# Altium project RX_test_01.PrjPcb (part 2 of 5)

## Sheet IF 1.SchDoc
size A3; SheetNumber: 4; SheetTotal: 13
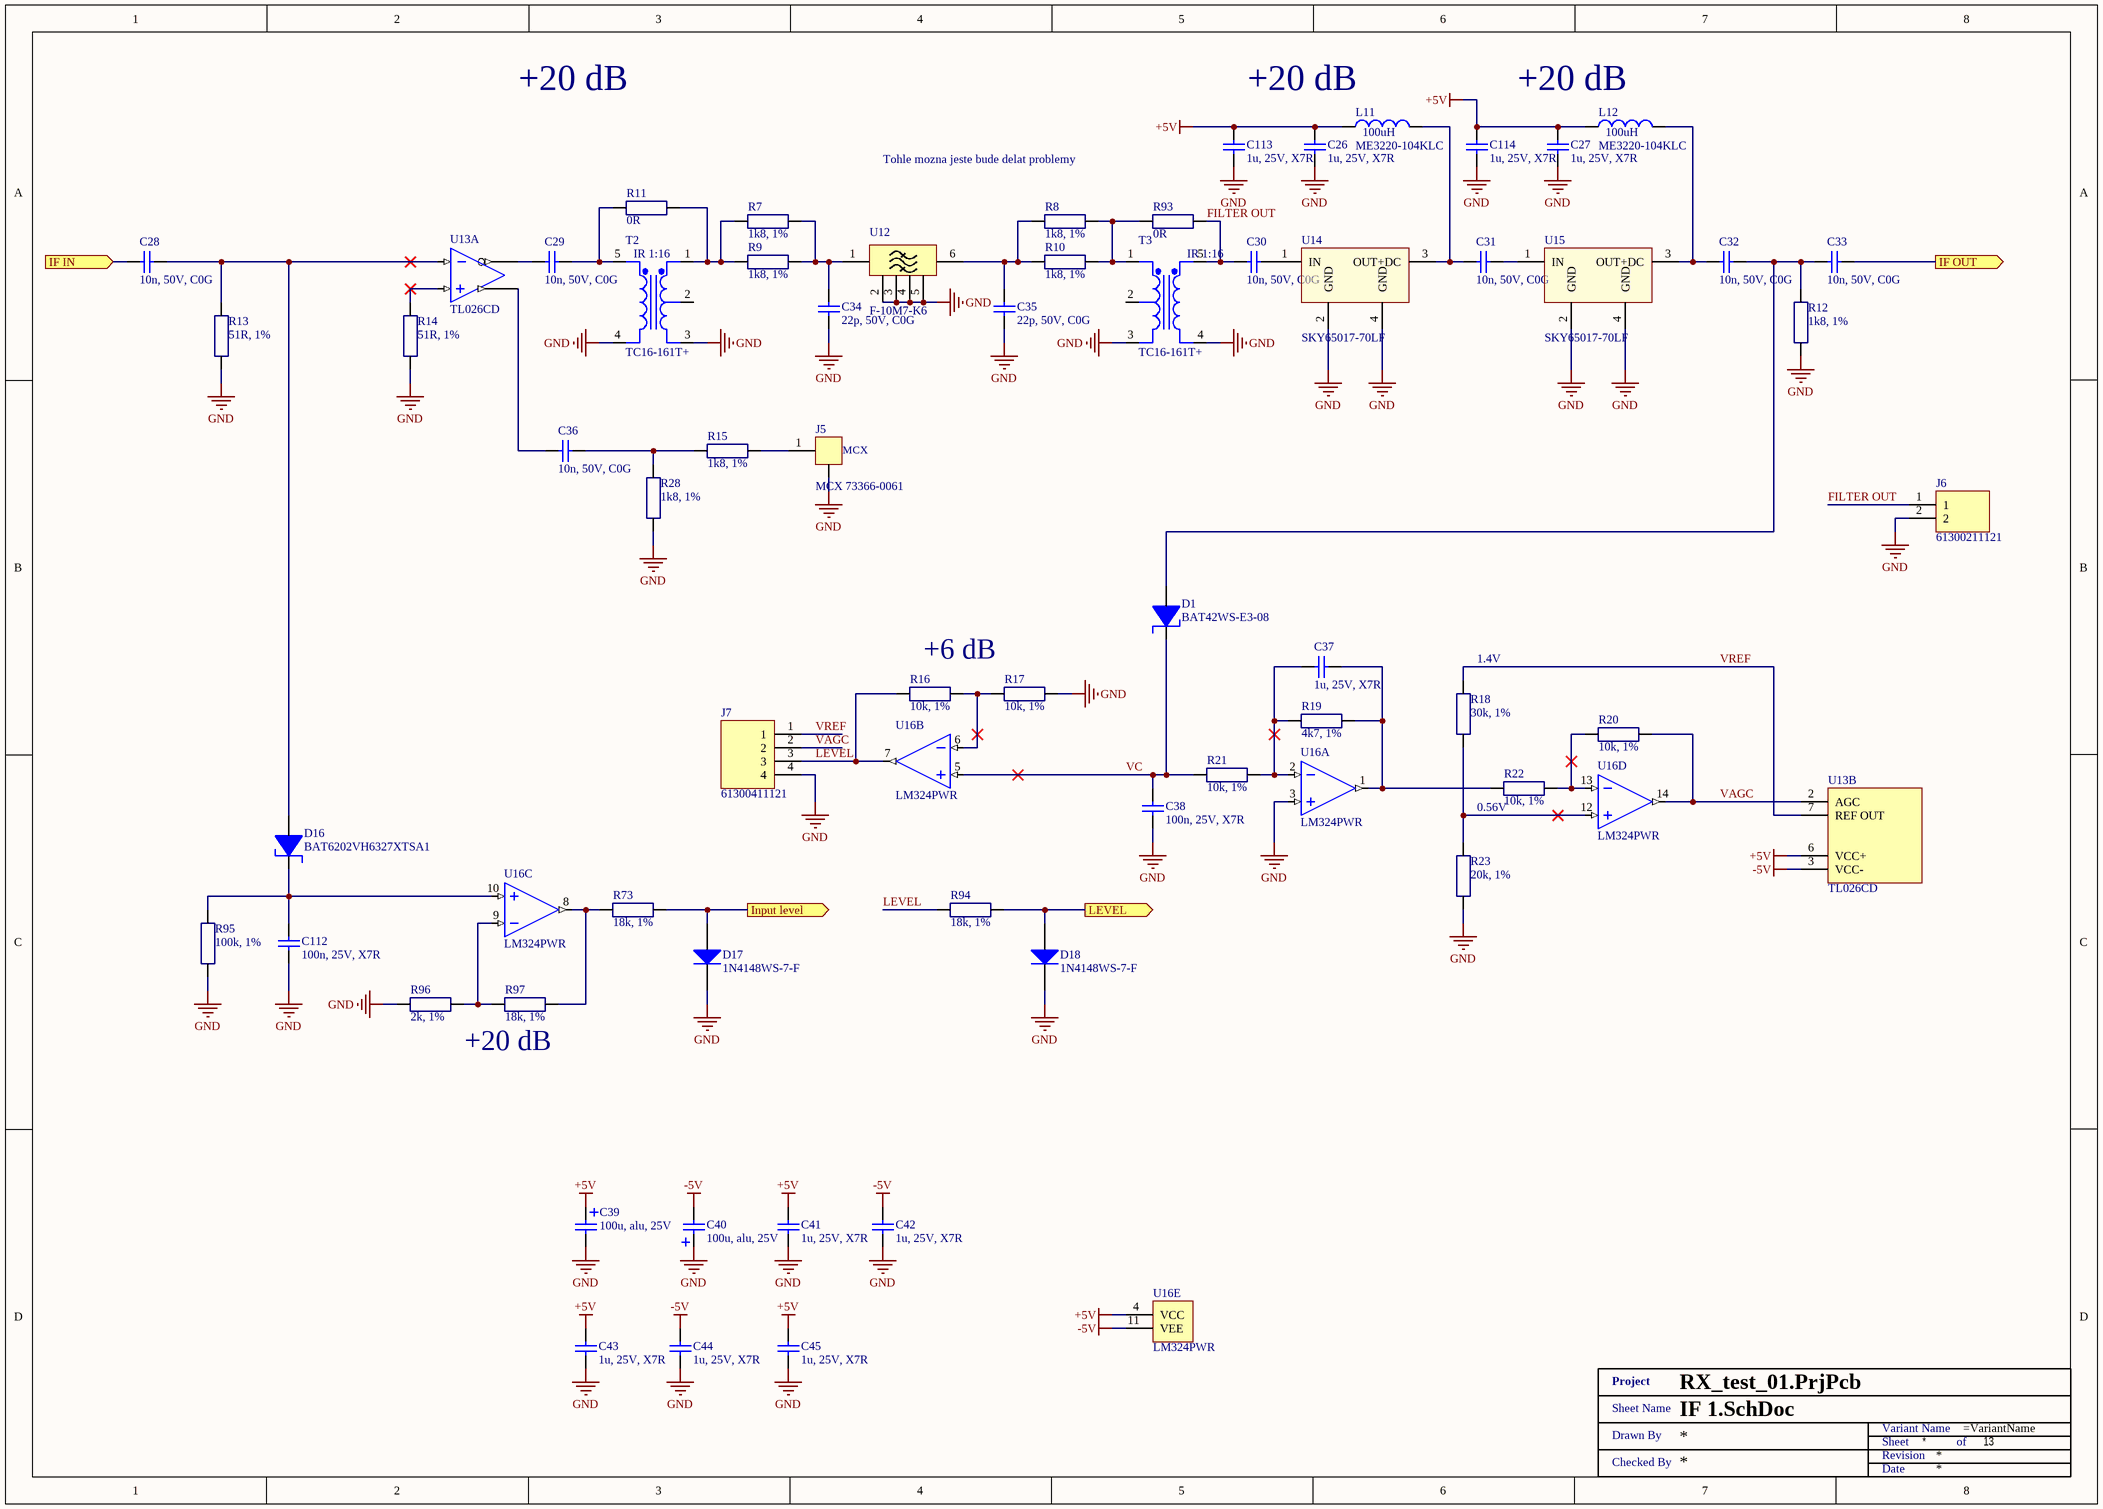
[diagram p3: IF 1.SchDoc]

### Parts
(Parts that share a designator on the sheet are numbered #1, #2 ... from top to bottom, then left to right.)
C26  1u, 25V, X7R  [SMD0603]
C27  1u, 25V, X7R  [SMD0603]
C28  10n, 50V, C0G  [SMD0603]
C29  10n, 50V, C0G  [SMD0603]
C30  10n, 50V, C0G  [SMD0603]
C31  10n, 50V, C0G  [SMD0603]
C32  10n, 50V, C0G  [SMD0603]
C33  10n, 50V, C0G  [SMD0603]
C34  22p, 50V, C0G  [SMD0603]
C35  22p, 50V, C0G  [SMD0603]
C36  10n, 50V, C0G  [SMD0603]
C37  1u, 25V, X7R  [SMD0603]
C38  100n, 25V, X7R  [SMD0603]
C39  100u, alu, 25V  [WCAP-ATLI_6.3x11x2.5]
C40  100u, alu, 25V  [WCAP-ATLI_6.3x11x2.5]
C41  1u, 25V, X7R  [SMD0603]
C42  1u, 25V, X7R  [SMD0603]
C43  1u, 25V, X7R  [SMD0603]
C44  1u, 25V, X7R  [SMD0603]
C45  1u, 25V, X7R  [SMD0603]
C112  100n, 25V, X7R  [SMD0603]
C113  1u, 25V, X7R  [SMD0603]
C114  1u, 25V, X7R  [SMD0603]
D1  BAT42WS-E3-08  [SOD-323]
D16  BAT6202VH6327XTSA1  [SC79]
D17  1N4148WS-7-F  [SOD-323]
D18  1N4148WS-7-F  [SOD-323]
J5  MCX 73366-0061  [73366-0061]
J6  61300211121  [Header 2 2.54mm]
J7  61300411121  [Header 4 2.54mm]
L11  ME3220-104KLC  [ME3220]
L12  ME3220-104KLC  [ME3220]
R7  1k8, 1%  [SMD0603 - R]
R8  1k8, 1%  [SMD0603 - R]
R9  1k8, 1%  [SMD0603 - R]
R10  1k8, 1%  [SMD0603 - R]
R11  0R  [SMD0603 - R]
R12  1k8, 1%  [SMD0603 - R]
R13  51R, 1%  [SMD0603 - R]
R14  51R, 1%  [SMD0603 - R]
R15  1k8, 1%  [SMD0603 - R]
R16  10k, 1%  [SMD0603 - R]
R17  10k, 1%  [SMD0603 - R]
R18  30k, 1%  [SMD0603 - R]
R19  4k7, 1%  [SMD0603 - R]
R20  10k, 1%  [SMD0603 - R]
R21  10k, 1%  [SMD0603 - R]
R22  10k, 1%  [SMD0603 - R]
R23  20k, 1%  [SMD0603 - R]
R28  1k8, 1%  [SMD0603 - R]
R73  18k, 1%  [SMD0603 - R]
R93  0R  [SMD0603 - R]
R94  18k, 1%  [SMD0603 - R]
R95  100k, 1%  [SMD0603 - R]
R96  2k, 1%  [SMD0603 - R]
R97  18k, 1%  [SMD0603 - R]
T2  TC16-161T+  [MABA-007159-000000]
T3  TC16-161T+  [MABA-007159-000000]
U12  F-10M7-K6  [F-10M7-K6]
U13  TL026CD  [SOIC08]  (parts A,B of 2)
U14  SKY65017-70LF  [SOT89]
U15  SKY65017-70LF  [SOT89]
U16  LM324PWR  [TSSOP14]  (parts A,B,C,D,E of 5)
XX?#4  Title 1  (value not drawn)  (graphical)

### Ports
IF IN (in), IF OUT (out), Input level (out), LEVEL (out)

### Nets
+5V: C26.2 C27.2 C39.1 C41.2 C43.2 C45.2 C113.2 C114.2 L11.1 L12.1 U13.6(VCC+) U16.4(VCC)
-5V: C40.2 C42.2 C44.2 U13.3(VCC-) U16.11(VEE)
GND: C26.1 C27.1 C34.1 C35.1 C38.1 C39.2 C40.1 C41.1 C42.1 C43.1 C44.1 C45.1 C112.1 C113.1 C114.1 D17.1(K) D18.1(K) J5.2(GND) J6.2 J7.4 R12.1 R13.1 R14.1 R17.2 R23.1 R28.1 R95.1 R96.1 T2.3(Secondary) T2.4(Primary) T3.3(Secondary) T3.4(Primary) U12.2(GND) U12.3(GND) U12.4(GND) U12.5(GND) U14.2(GND) U14.4(GND) U15.2(GND) U15.4(GND) U16.3(+IN_A)
FILTER OUT: C30.1 J6.1 R93.2 T3.5(Primary_Dot)
LEVEL: J7.3 R16.1 R94.1 U16.7(OUT_B)
VAGC: J7.2 R20.2 U13.2(AGC) U16.14(OUT_D)
VC: C38.2 D1.1(C) R21.1 U16.5(+IN_B)
VREF: J7.1 R18.2 U13.7(REF_OUT)
NetC28_1: C28.1 ; port IF IN
NetC28_2: C28.2 D16.2(A) R13.2 U13.8(IN-)
NetC29_1: C29.1 U13.5(OUT-)
NetC29_2: C29.2 R11.1 T2.5(Primary_Dot)
NetC30_2: C30.2 U14.1(IN)
NetC31_1: C31.1 L11.2 U14.3(OUT+DC)
NetC31_2: C31.2 U15.1(IN)
NetC32_1: C32.1 L12.2 U15.3(OUT+DC)
NetC32_2: C32.2 C33.1 D1.2(A) R12.2
NetC33_2: C33.2 ; port IF OUT
NetC34_2: C34.2 R7.1 R9.1 U12.1(IN)
NetC35_2: C35.2 R8.2 R10.2 U12.6(OUT)
NetC36_1: C36.1 U13.4(OUT+)
NetC36_2: C36.2 R15.1 R28.2
NetC37_1: C37.1 R19.2 R22.1 U16.1(OUT_A)
NetC37_2: C37.2 R19.1 R21.2 U16.2(-IN_A)
NetC112_2: C112.2 D16.1(C) R95.2 U16.10(+IN_C)
NetD17_2: D17.2(A) R73.2 ; port Input level
NetD18_2: D18.2(A) R94.2 ; port LEVEL
NetJ5_1: J5.1(INPUT) R15.2
NetR7_2: R7.2 R9.2 R11.2 T2.1(Secondary_Dot)
NetR8_1: R8.1 R10.1 R93.1 T3.1(Secondary_Dot)
NetR14_2: R14.2 U13.1(IN+)
NetR16_2: R16.2 R17.1 U16.6(-IN_B)
NetR18_1: R18.1 R23.2 U16.12(+IN_D)
NetR20_1: R20.1 R22.2 U16.13(-IN_D)
NetR73_1: R73.1 R97.2 U16.8(OUT_C)
NetR96_2: R96.2 R97.1 U16.9(-IN_C)

Not connected (* = marked no-connect by the designer): T2 2(Secondary_CT); T3 2(Secondary_CT)

### Notes on the sheet
- +20 dB
- Tohle mozna jeste bude delat problemy
- +6 dB
- (near R18) 1.4V
- (near R22) 0.56V
- (in symbol ME3220-104KLC) 100uH
- (in symbol TC16-161T+) IR 1:16
- (in symbol Title 1) Project; Sheet Name; Variant Name; Drawn By; Sheet; of; Revision; Checked By; Date

### Library data of the parts
C26 C27 C37 C41-C45 C113 C114 = CGA3E1X7R1E105K080AC: CAP CER 1UF 25V X7R 0603; Manufacturer: TDK Corporation; Tolerance: ±10%; Manufacturer Part Number: CGA3E1X7R1E105K080AC; RoHS: RoHS Compliant; Category: Capacitors; Stock 1: 109509; Pricing 1: 1=0.2, 10=0.135, 100=0.0686, 500=0.04696, 1000=0.04154 (USD); Packaging: Cut Tape (CT); Part Status: Active; Voltage - Rated: 25V; Temperature Coefficient: X7R; Operating Temperature: -55°C ~ 125°C; Features: -; Ratings: AEC-Q200; Applications: Automotive; Failure Rate: -; Mounting Type: Surface Mount, MLCC; Package / Case: 0603 (1608 Metric); Size / Dimension: 0.063" L x 0.032" W (1.60mm x 0.80mm); Height - Seated (Max): -; Thickness (Max): 0.035" (0.90mm); Lead Spacing: -; Lead Style: -; ComponentLink1URL: https://product.tdk.com/info/en/catalog/datasheets/mlcc_automotive_general_en.pdf; ComponentLink1Description: https://product.tdk.com/info/en/catalog/datasheets/mlcc_automotive_general_en.pdf; Capacitance: 1u; Supplier 1: Mouser; Supplier Part Number 1: 810-CGA3E1X7R1E105K; Supplier 2: Farnell; Supplier Part Number 2: 2346962; Supplier 3: Digi-Key; Supplier Part Number 3: 445-6931-1-ND
C28-C33 C36 = GRM1885C1H103JA01D: Multilayer Ceramic Capacitors MLCC - SMD/SMT 0603 50VDC 10000pF 5% C0G; Manufacturer: Murata Electronics; Type: Chip Multilayer Ceramic Capacitor for General Purpose; Capacitance - nF: 10 nF; Class: Class 1; CNHTS: 8532241000; Dielectric: C0G (NP0); TARIC: 8532240000; Supplier 1: Mouser; Supplier Part Number 1: 81-GRM1885C1H103JA1D; Manufacturer Part Number: GRM1885C1H103JA01D; RoHS: RoHS Compliant; Category: Multilayer Ceramic Capacitors MLCC - SMD/SMT; Stock 1: 217291; Pricing 1: 1=0.183, 10=0.129, 100=0.065, 500=0.045, 1000=0.039, 4000=0.030, 8000=0.027, 24000=0.025 (EUR); Capacitance: 10n; Height: 0.8 mm; Length: 1.6 mm; Package / Case: 0603 (1608 metric); Packaging: Cut Tape; Product: General Type MLCCs; Series: GRM; Termination Style: SMD/SMT; Tolerance: 5 %; Voltage Rating DC: 50 VDC; Width: 0.8 mm; Brand: Murata Electronics; Capacitance - pF: 10000 pF; Case Code - in: 0603; Case Code - mm: 1608; HTS Code: 8532240020; Maximum Operating Temperature: + 125 C; Minimum Operating Temperature: - 55 C; Product Type: Ceramic Capacitors; Standard Pack Qty: 4000; Subcategory: Capacitors; Termination: Standard; RoHS - Mouser: Y; Minimum Order Quantity: 1; Reeling: True; ComponentLink1URL: http://www.mouser.com/datasheet/2/281/murata_03052018_GRM_Series_1-1310166.pdf; ComponentLink1Description: http://www.mouser.com/datasheet/2/281/murata_03052018_GRM_Series_1-1310166.pdf; Supplier 2: Farnell; Supplier Part Number 2: 2456107
C34 C35 = MC0603N220J500CT: MULTICOMP - MC0603N220J500CT - CAP, MLCC, C0G/NP0, 22PF, 50V, 0603; Manufacturer: MULTICOMP; Manufacturer Part Number: MC0603N220J500CT; RoHS: YES; Stock 1: 184439; Pricing 1: 10=0.0077, 100=0.0065, 500=0.0052, 1000=0.0044, 2000=0.0038 (GBP); ComponentLink1URL: http://www.farnell.com/datasheets/1901289.pdf; ComponentLink1Description: http://www.farnell.com/datasheets/1901289.pdf; Capacitance: 22p; Supplier 1: Farnell; Supplier Part Number 1: 1759057; Supplier 2: Newark; Supplier Part Number 2: 94W8766
C38 C112 = 06033C104KAT2A: AVX - 06033C104KAT2A - CAP, MLCC, X7R, 0.1UF, 25V, 0603; Ceramic Capacitor Case: 0603 [1608 Metric]; Voltage Rating: 25; Capacitance Tolerance: ± 10%; Dielectric Characteristic: X7; Product Range: AVX 0603 MLCC; SVHC: No SVHC (17-Dec-2015)<!--FANDB--><div class="features-and-benefits-container"><div class="features-and-benefits-desc-container"><span class="features-and-benefits-container-desc">SMD Multilayer Ceramic Capacitor, 0603 [1608 Metric], 0.1 µF, 25 V, ± 10%, X7R, AVX 0603 MLCC</span></div><div class="features-and-benefits-description"><span class="features-benefits-value">The 06033C104KAT2A is a SMD Multilayer Ceramic Capacitor with Ni/Sn-plated termination, X7R dielectric and 0603 case. X7R formulations are called temperature stable ceramics and fall into EIA class II materials. X7R is the most popular of this intermediate dielectric constant material. This capacitance change is non-linear. Capacitance for X7R varies under the influence of electrical operating conditions such as voltage and frequency. X7; Supplier 1: Farnell; Supplier Part Number 1: 2530141; Manufacturer: AVX; Manufacturer Part Number: 06033C104KAT2A; RoHS: YES; Stock 1: 22809; Pricing 1: 10=0.012, 100=0.0096, 500=0.0069, 1000=0.006, 2000=0.0048, 4000=0.0038, 20000=0.0027, 40000=0.0026 (GBP); Capacitance: 100n; Packaging: Cut Tape; Operating Temperature Min: -55; Operating Temperature Max: 125; Automotive Qualification Standard: -; MSL: MSL 1 - Unlimited; ComponentLink1URL: http://www.farnell.com/datasheets/2237835.pdf; ComponentLink1Description: http://www.farnell.com/datasheets/2237835.pdf; Supplier 2: Digi-Key; Supplier Part Number 2: 478-3714-1-ND
C39 C40 = 860010473007: CAP 100 UF 20% 25 V; Manufacturer: Wurth Electronics; Material: Aluminium; Capacitance: 100uF; Polarity: Polar; Ripple Current: 209mA; Life (Hours): 2000Hour; Supplier 1: Mouser; Supplier Part Number 1: 710-860010473007; Manufacturer Part Number: 860010473007; RoHS: Yes; Category: Aluminum Electrolytic Capacitors; Stock 1: 1494; Pricing 1: 1=0.14000, 10=0.13400, 25=0.13400, 50=0.11200, 100=0.09800, 250=0.08700 (USD); Mount: Through Hole; Case/Package: Radial; Min Operating Temperature: -40°C; Max Operating Temperature: 85°C; Tolerance: 20%; Voltage Rating (DC): 25V; Package Quantity: 1500; Packaging: Tape and Reel; Voltage Rating: 25V; Diameter: 6.3mm; Height: 11mm; Lead Pitch: 0.098inch; Height - Seated (Max): 0.492inch; REACH SVHC: Unknown; ComponentLink1URL: https://datasheet.ciiva.com/48693/001280151-da-01-en-wcap-atg8-alu-elec-caps-860010473007-48693591.pdf?src-supplier=Conrad; ComponentLink1Description: https://datasheet.ciiva.com/48693/001280151-da-01-en-wcap-atg8-alu-elec-caps-860010473007-48693591.pdf?src-supplier=Conrad; Supplier 2: Farnell; Supplier Part Number 2: 2465675; Supplier 3: Digi-Key; Supplier Part Number 3: 732-8630-1-ND
D1 = BAT42WS-E3-08: DIODE SCHOTTKY 30V 200MA SOD323; Manufacturer: Vishay Semiconductor Diodes Division; Current - Average Rectified (Io): 200mA (DC); Speed: Small Signal =< 200mA (Io), Any Speed; Capacitance @ Vr, F: 7pF @ 1V, 1MHz; Supplier 1: Digi-Key; Supplier Part Number 1: BAT42WS-E3-08-ND; Manufacturer Part Number: BAT42WS-E3-08; RoHS: RoHS Compliant; Category: Discrete Semiconductor Products; Stock 1: 0; Pricing 1: 15000=0.0504 (USD); Packaging: Tape & Reel (TR); Part Status: Active; Diode Type: Schottky; Mounting Type: Surface Mount; Package / Case: SC-76, SOD-323; Supplier Device Package: SOD-323; Operating Temperature - Junction: 125°C (Max); ComponentLink1URL: http://www.vishay.com/docs/81813/bat42wsv.pdf; ComponentLink1Description: http://www.vishay.com/docs/81813/bat42wsv.pdf; Supplier 2: Mouser; Supplier Part Number 2: 78-BAT42WS-E3-08
D16 = BAT6202VH6327XTSA1: Low barrier diode for detectors up to GHz frequencies, SC79, RoHS; Manufacturer: Infineon; Average Rectified Current: 20mA; Max Repetitive Reverse Voltage (Vrrm): 40V; Element Configuration: Single; Supplier 1: Mouser; Supplier Part Number 1: 726-BAT6202VH6327XTS; Manufacturer Part Number: BAT6202VH6327XTSA1; RoHS: Yes; Category: Rectifier Diodes; Stock 1: 8967; Pricing 1: 1=0.52000, 10=0.42300, 50=0.42300, 100=0.28800, 500=0.21600, 1000=0.16200, 3000=0.14800, 6000=0.13900, 9000=0.13000, 10000=0.13000 (USD); Mount: Surface Mount; Number of Pins: 2; Min Operating Temperature: -55°C; Max Operating Temperature: 150°C; Packaging: Tape and Reel; Forward Current: 20mA; Max Reverse Voltage (DC): 40V; RoHS Compliant: Yes; ComponentLink1URL: http://www.farnell.com/datasheets/1835974.pdf?src-supplier=Farnell; ComponentLink1Description: http://www.farnell.com/datasheets/1835974.pdf?src-supplier=Farnell; ComponentLink2URL: http://www.mouser.com/ds/2/196/Infineon-BAT62SERIES-DS-v01_01-en-539993.pdf?src-supplier=Mouser; ComponentLink2Description: http://www.mouser.com/ds/2/196/Infineon-BAT62SERIES-DS-v01_01-en-539993.pdf?src-supplier=Mouser; ComponentLink3URL: https://www.infineon.com/dgdl/bat62series.pdf?folderId=db3a304314dca389011518104e5d0df2&fileId=db3a304314dca3890115181141bf0df3&src-supplier=Digi-Key; ComponentLink3Description: https://www.infineon.com/dgdl/bat62series.pdf?folderId=db3a304314dca389011518104e5d0df2&fileId=db3a304314dca3890115181141bf0df3&src-supplier=Digi-Key; ComponentLink4URL: http://www.infineon.com/dgdl/Infineon-BAT62SERIES-DS-v01_01-en.pdf?fileId=db3a304314dca3890115181141bf0df3&src-supplier=Avnet; ComponentLink4Description: http://www.infineon.com/dgdl/Infineon-BAT62SERIES-DS-v01_01-en.pdf?fileId=db3a304314dca3890115181141bf0df3&src-supplier=Avnet; Supplier 2: Farnell; Supplier Part Number 2: 2725714; Supplier 3: Digi-Key; Supplier Part Number 3: BAT6202VH6327XTSA1CT-ND
D17 D18 = 1N4148WS-7-F: DIODES INC. - 1N4148WS-7-F - DIODE, SS SWITCH, 75V, 0.2W, SOD323; Diode Configuration: Single; Repetitive Reverse Voltage Vrrm Max: 75; Forward Current If(AV): 150; Forward Voltage VF Max: 1.25; Reverse Recovery Time trr Max: 4; Forward Surge Current Ifsm Max: 2; Product Range: 1N4148 Series; SVHC: No SVHC (17-Dec-2015); Diode Type: Switching; Supplier 1: Farnell; Supplier Part Number 1: 1843678; Manufacturer: DIODES INC.; Manufacturer Part Number: 1N4148WS-7-F; RoHS: YES; Stock 1: 64008; Pricing 1: 1=0.186, 25=0.142, 100=0.0928, 250=0.0514, 500=0.0433, 1000=0.0256, 3000=0.025, 8000=0.0239 (GBP); Operating Temperature Max: 150; Diode Case Style: SOD-323; No. of Pins: 2; Packaging: Cut Tape; MSL: MSL 1 - Unlimited; Operating Temperature Min: -65; Operating Temperature Range: -65°C to +150°C<!--FANDB--><div class="features-and-benefits-container"><div class="features-and-benefits-description"><span class="features-benefits-value">The 1N4148WS-7-F is a surface mount fast Switching Diode with matte tin-plated terminals and an UL94V-0 green molding compound molded plastic case. Solderable terminals as per MIL-STD-202, method 208 standard. Color band denotes cathode end polarity. It is suitable for general purpose switching applications.</span></div><div class="features-and-benefits-list"><ul class="features-and-benefits-list-list"><li class="features-and-benefits-list-item">Fast switching speed</li><li class="features-and-benefits-list-item">100V Non-repetitive peak reverse voltage</li><li class="features-and-benefits-list-item">53V RMS reverse voltage</li><li class="features-and-benefits-list-item">200mW Power dissipation</li><li class="features-and-benefits-list-item">625; ComponentLink1URL: http://www.farnell.com/datasheets/1911818.pdf; ComponentLink1Description: http://www.farnell.com/datasheets/1911818.pdf
J5 = 73366-0061: CONN MCX JACK STR 50 OHM PCB; Manufacturer: Molex, LLC; Manufacturer Part Number: 0733660061; Connector Type: Jack, Female Socket; Contact Termination: Solder; Impedance: 50 Ohm; Body Material: Brass; Body Finish: Gold; Dielectric Material: Polytetrafluoroethylene (PTFE); Center Contact Material: Beryllium Copper; Mating Cycles: 500; RoHS: RoHS Compliant; Category: Connectors, Interconnects; Stock 1: 39394; Pricing 1: 1=1.95, 10=1.765, 25=1.6572, 50=1.5854, 100=1.5133, 250=1.36916, 500=1.26106, 1000=1.0809, 2500=1.00884 (USD); Packaging: Tray; Part Status: Active; Connector Style: MCX; Shield Termination: Solder; Mounting Type: Through Hole; Mounting Feature: -; Cable Group: -; Fastening Type: Snap-On; Features: -; Housing Color: Gold; Ingress Protection: -; Includes: -; Center Contact Plating: Gold; Operating Temperature: -55°C ~ 155°C; Insertion Loss: -; ComponentLink1URL: https://www.molex.com/pdm_docs/sd/733660061_sd.pdf; ComponentLink1Description: https://www.molex.com/pdm_docs/sd/733660061_sd.pdf; Supplier 1: Mouser; Supplier Part Number 1: 538-73366-0061; Supplier 2: Digi-Key; Supplier Part Number 2: WM5541-ND; Supplier 3: Farnell; Supplier Part Number 3: 1909245
J6 = 61300211121: CONN HEADER 2 POS 2.54; Manufacturer: Wurth Electronics Inc.; Pitch - Mating: 0.100" (2.54mm); Number of Positions: 2; Number of Positions Loaded: All; Style: Board to Board or Cable; Shrouding: Unshrouded; Contact Length - Mating: 0.236" (6.00mm); Contact Length - Post: 0.118" (3.00mm); Overall Contact Length: 0.454" (11.54mm); Material Flammability Rating: UL94 V-0; Current Rating: 3A; Voltage Rating: 250V; Manufacturer Part Number: 61300211121; RoHS: RoHS Compliant; Category: Connectors, Interconnects; Stock 1: 164911; Pricing 1: 1=0.13, 10=0.106, 25=0.088, 50=0.074, 100=0.067, 1000=0.061 (USD); Packaging: Bulk; Part Status: Active; Connector Type: Header; Contact Type: Male Pin; Number of Rows: 1; Row Spacing - Mating: -; Mounting Type: Through Hole; Termination: Solder; Fastening Type: Push-Pull; Insulation Height: 0.100" (2.54mm); Contact Shape: Square; Contact Finish - Mating: Gold; Contact Finish Thickness - Mating: -; Contact Finish - Post: -; Contact Material: Copper Alloy; Insulation Material: Polybutylene Terephthalate (PBT); Features: -; Operating Temperature: -40°C ~ 125°C; Ingress Protection: -; Insulation Color: Black; Mated Stacking Heights: -; Contact Finish Thickness - Post: -; Applications: -; ComponentLink1URL: https://katalog.we-online.de/em/datasheet/6130xx11121.pdf; ComponentLink1Description: https://katalog.we-online.de/em/datasheet/6130xx11121.pdf; Supplier 1: Mouser; Supplier Part Number 1: 710-61300211121; Supplier 2: Farnell; Supplier Part Number 2: 2356153; Supplier 3: Digi-Key; Supplier Part Number 3: 732-5315-ND
J7 = 61300411121: CONN HEADER 4 POS 2.54; Manufacturer: Wurth Electronics Inc.; Pitch - Mating: 0.100" (2.54mm); Number of Positions: 4; Number of Positions Loaded: All; Style: Board to Board or Cable; Shrouding: Unshrouded; Contact Length - Mating: 0.236" (6.00mm); Contact Length - Post: 0.118" (3.00mm); Overall Contact Length: 0.454" (11.54mm); Material Flammability Rating: UL94 V-0; Current Rating: 3A; Voltage Rating: 250V; Manufacturer Part Number: 61300411121; RoHS: RoHS Compliant; Category: Connectors, Interconnects; Stock 1: 22863; Pricing 1: 1=0.18, 10=0.153, 25=0.1272, 50=0.106, 100=0.096, 1000=0.088 (USD); Packaging: Bulk; Part Status: Active; Connector Type: Header; Contact Type: Male Pin; Number of Rows: 1; Row Spacing - Mating: -; Mounting Type: Through Hole; Termination: Solder; Fastening Type: Push-Pull; Insulation Height: 0.100" (2.54mm); Contact Shape: Square; Contact Finish - Mating: Gold; Contact Finish Thickness - Mating: -; Contact Finish - Post: -; Contact Material: Copper Alloy; Insulation Material: Polybutylene Terephthalate (PBT); Features: -; Operating Temperature: -40°C ~ 125°C; Ingress Protection: -; Insulation Color: Black; Mated Stacking Heights: -; Contact Finish Thickness - Post: -; Applications: -; ComponentLink1URL: https://katalog.we-online.de/em/datasheet/6130xx11121.pdf; ComponentLink1Description: https://katalog.we-online.de/em/datasheet/6130xx11121.pdf; Supplier 1: Mouser; Supplier Part Number 1: 710-61300411121; Supplier 2: Farnell; Supplier Part Number 2: 2356155; Supplier 3: Digi-Key; Supplier Part Number 3: 732-5317-ND
L11 L12 = ME3220-104KLC: Fixed Inductors ME3220 SMT Power 100 uH 10 % 0.32 A; Manufacturer: Coilcraft; Core Material: Ferrite; Tolerance: 10%; Self Resonant Frequency: 13.3MHz; Inductance: 100u; Max DC Current: 320mA; DC Resistance (DCR): 3.5R; Test Frequency: 100kHz; Supplier 1: Mouser; Supplier Part Number 1: 994-ME3220-104KLC; Manufacturer Part Number: ME3220-104KLC; RoHS: Yes; Category: Fixed Inductors; Stock 1: 420; Pricing 1: 1=0.70000, 10=0.59400, 50=0.57500, 100=0.51800, 1000=0.36200, 10000=0.33300 (USD); Case/Package: 100; Min Operating Temperature: -40°C; Max Operating Temperature: 85°C; Packaging: Tape and Reel; Termination: SMD/SMT; Series: ME3220; Length: 3.5mm; Width: 2.7mm; Height: 2.4mm; Lead Free: Contains Lead; RoHS Compliant: Yes; ComponentLink1URL: http://www.mouser.com/ds/2/597/me3220-270645.pdf?src-supplier=Mouser; ComponentLink1Description: http://www.mouser.com/ds/2/597/me3220-270645.pdf?src-supplier=Mouser; Supplier 2: Farnell; Supplier Part Number 2: 2287937
R7-R10 R12 R15 R28 = RC0603FR-071K8L: Res Thick Film 0603 1.8K Ohm 1% 0.1W(1/10W) ±100ppm/C Molded SMD Paper T/R; Manufacturer: Yageo; Voltage Rating (DC): 50V; Temperature Coefficient: 100ppm/°C; Max Power Dissipation: 100mW; Supplier 1: Mouser; Supplier Part Number 1: 603-RC0603FR-071K8L; Manufacturer Part Number: RC0603FR-071K8L; RoHS: Yes; Category: Chip SMD Resistors; Stock 1: 505177; Pricing 1: 1=0,10000, 10=0,01800, 100=0,00600, 1000=0,00500, 5000=0,00300, 10000=0,00300 (USD); Case/Package: 0603; Number of Pins: 2; Case Code (Metric): 1608; Case Code (Imperial): 0603; Min Operating Temperature: -55°C; Max Operating Temperature: 155°C; Resistance: 1k8; Tolerance: 1%; Composition: Thick Film; Packaging: Tape and Reel; Features: Moisture Resistant; Power Rating: 100mW; Voltage Rating: 50V; Number of Terminations: 2; Package Quantity: 5000; Termination: SMD/SMT; Military Standard: Not; Length: 1.6mm; Height: 0.45mm; Width: 0.8mm; Depth: 0.8mm; Lead Free: Lead Free; REACH SVHC: No SVHC; ComponentLink1URL: https://datasheet.ciiva.com/11808/0900766b80f96399-11808105.pdf?src-supplier=RSComponents; ComponentLink1Description: https://datasheet.ciiva.com/11808/0900766b80f96399-11808105.pdf?src-supplier=RSComponents; ComponentLink2URL: https://datasheet.ciiva.com/2519/pyu-r-int-thick-7-2519189.pdf?src-supplier=Digi-Key; ComponentLink2Description: https://datasheet.ciiva.com/2519/pyu-r-int-thick-7-2519189.pdf?src-supplier=Digi-Key; ComponentLink3URL: https://datasheet.ciiva.com/7746/443971-7746277.pdf?src-supplier=Element14; ComponentLink3Description: https://datasheet.ciiva.com/7746/443971-7746277.pdf?src-supplier=Element14; ComponentLink4URL: https://datasheet.ciiva.com/2519/pyu-r-int-thick-7-2519190.pdf?src-supplier=Digi-Key; ComponentLink4Description: https://datasheet.ciiva.com/2519/pyu-r-int-thick-7-2519190.pdf?src-supplier=Digi-Key; ComponentLink5URL: https://datasheet.ciiva.com/7746/443971-7746278.pdf?src-supplier=Element14; ComponentLink5Description: https://datasheet.ciiva.com/7746/443971-7746278.pdf?src-supplier=Element14; ComponentLink6URL: https://datasheet.ciiva.com/12558/rc0603-272842-12558694.pdf?src-supplier=Mouser; ComponentLink6Description: https://datasheet.ciiva.com/12558/rc0603-272842-12558694.pdf?src-supplier=Mouser; ComponentLink7URL: https://datasheet.ciiva.com/2519/pyu-r-int-thick-7-2519191.pdf?src-supplier=Digi-Key; ComponentLink7Description: https://datasheet.ciiva.com/2519/pyu-r-int-thick-7-2519191.pdf?src-supplier=Digi-Key; Supplier 2: Digi-Key; Supplier Part Number 2: 311-1.80KHRCT-ND; Supplier 3: Farnell; Supplier Part Number 3: 2693664
R11 R93 = CRCW06030000Z0EA: RES SMD 0 OHM JUMPER 1/10W 0603; Manufacturer: Vishay Dale; Power (Watts): 0.1W, 1/10W; Manufacturer Part Number: CRCW06030000Z0EA; RoHS: RoHS Compliant; Category: Resistors; Stock 1: 0; Pricing 1: 1=0.1, 10=0.028, 25=0.0204, 50=0.0154, 100=0.0114, 250=0.00868, 500=0.00694, 1000=0.00511 (USD); Packaging: Cut Tape (CT); Part Status: Active; Tolerance: Jumper; Composition: Thick Film; Features: Automotive AEC-Q200; Temperature Coefficient: -; Operating Temperature: -55°C ~ 155°C; Package / Case: 0603 (1608 Metric); Supplier Device Package: 0603; Size / Dimension: 0.063" L x 0.033" W (1.60mm x 0.85mm); Height - Seated (Max): 0.020" (0.50mm); Failure Rate: -; ComponentLink1URL: http://www.vishay.com/docs/20035/dcrcwe3.pdf; ComponentLink1Description: http://www.vishay.com/docs/20035/dcrcwe3.pdf; Resistance: 0R; Supplier 1: Mouser; Supplier Part Number 1: 71-CRCW0603-0-E3; Supplier 2: Farnell; Supplier Part Number 2: 1469739; Supplier 3: Digi-Key; Supplier Part Number 3: 541-0.0GCT-ND
R13 R14 = CRCW060351R0FKEA: RES SMD 51 OHM 1% 1/10W 0603; Manufacturer: Vishay Dale; Power (Watts): 0.1W, 1/10W; Temperature Coefficient: ±100ppm/°C; Manufacturer Part Number: CRCW060351R0FKEA; RoHS: RoHS Compliant; Category: Resistors; Stock 1: 21691; Pricing 1: 1=0.1, 10=0.042, 100=0.017, 1000=0.00764, 2500=0.00663 (USD); Packaging: Cut Tape (CT); Part Status: Active; Tolerance: ±1%; Composition: Thick Film; Features: Automotive AEC-Q200; Operating Temperature: -55°C ~ 155°C; Package / Case: 0603 (1608 Metric); Supplier Device Package: 0603; Size / Dimension: 0.063" L x 0.033" W (1.60mm x 0.85mm); Height - Seated (Max): 0.020" (0.50mm); Failure Rate: -; ComponentLink1URL: http://www.vishay.com/docs/20035/dcrcwe3.pdf; ComponentLink1Description: http://www.vishay.com/docs/20035/dcrcwe3.pdf; Resistance: 51R; Supplier 1: Mouser; Supplier Part Number 1: 71-CRCW0603-51-E3; Supplier 2: Farnell; Supplier Part Number 2: 1652889; Supplier 3: Digi-Key; Supplier Part Number 3: 541-51.0HCT-ND
R16 R17 R20-R22 = RC0603FR-0710KL: YAGEO (PHYCOMP) - RC0603FR-0710KL - RES, THICK FILM, 10K, 1%, 0.1W, 0603; Voltage Rating: 50; Resistor Case Style: 0603 [1608 Metric]; Power Rating: 100; Product Range: RC Series; Temperature Coefficient: ± 100; SVHC: No SVHC (20-Jun-2016); Manufacturer: YAGEO (PHYCOMP); Manufacturer Part Number: RC0603FR-0710KL; RoHS: YES; Stock 1: 9995; Pricing 1: 5000=0.0025, 25000=0.0014, 50000=0.0013 (GBP); Resistance: 10k; Resistance Tolerance: ± 1%; Packaging: Tape & Reel; Resistor Element Material: Thick Film; Automotive Qualification Standard: -; MSL: MSL 1 - Unlimited<!--FANDB--><div class="features-and-benefits-container"><div class="features-and-benefits-desc-container"><span class="features-and-benefits-container-desc">SMD Chip Resistor, Thick Film, 10 kohm, 50 V, 0603 [1608 Metric], 100 mW, ± 1; ComponentLink1URL: http://past.yageo.com/pdf/PYu-R_Packing_6.pdf; ComponentLink1Description: http://past.yageo.com/pdf/PYu-R_Packing_6.pdf; ComponentLink2URL: http://www.farnell.com/datasheets/2167052.pdf; ComponentLink2Description: http://www.farnell.com/datasheets/2167052.pdf; Supplier 1: Mouser; Supplier Part Number 1: 603-RC0603FR-0710KL; Supplier 2: Farnell; Supplier Part Number 2: 2421850; Supplier 3: Digi-Key; Supplier Part Number 3: 311-10.0KHRCT-ND
R18 = RC0603FR-0730KL: YAGEO - RC0603FR-0730KL - RES, THICK FILM, 30K, 1%, 0.1W, 0603, REEL; Power Rating: 100mW; Temperature Coefficient: 100ppm/°C; Voltage Rating (DC): 50V; Supplier 1: Mouser; Supplier Part Number 1: 603-RC0603FR-0730KL; Manufacturer: Yageo; Manufacturer Part Number: RC0603FR-0730KL; RoHS: Yes; Category: Chip SMD Resistors; Stock 1: 345417; Pricing 1: 1=0.10000, 10=0.01800, 50=0.01800, 100=0.00600, 1000=0.00500, 10000=0.00300 (USD); Case/Package: 0603; Number of Pins: 2; Case Code (Imperial): 0603; Case Code (Metric): 1608; Size Code: 0603; Min Operating Temperature: -55°C; Max Operating Temperature: 155°C; Resistance: 30k; Tolerance: 1%; Packaging: Tape and Reel; Number of Terminations: 2; Voltage Rating: 50V; Package Quantity: 5000; Termination: SMD/SMT; Resistor Type: Thick Film; Features: Moisture Resistant; Series: RC; Max Power Dissipation: 100mW; Construction: Rectangular; Resistance Tolerance: 1%; Length: 1.6mm; Width: 0.8mm; Height: 0.45mm; Depth: 0.8mm; Lead Free: Lead Free; REACH SVHC: Unknown; Military Standard: Not; RoHS Compliant: Yes; ComponentLink1URL: https://datasheet.ciiva.com/12558/rc0603-272842-12558744.pdf?src-supplier=Mouser; ComponentLink1Description: https://datasheet.ciiva.com/12558/rc0603-272842-12558744.pdf?src-supplier=Mouser; ComponentLink2URL: https://datasheet.ciiva.com/46395/443971-46395003.pdf?src-supplier=Element14; ComponentLink2Description: https://datasheet.ciiva.com/46395/443971-46395003.pdf?src-supplier=Element14; Supplier 2: Farnell; Supplier Part Number 2: 3495811; Supplier 3: Digi-Key; Supplier Part Number 3: 311-30.0KHRCT-ND
R19 = AC0603FR-074K7L: RES SMD 4.7K OHM 1% 1/10W 0603; Manufacturer: Yageo; Power (Watts): 0.1W, 1/10W; Temperature Coefficient: ±100ppm/°C; Manufacturer Part Number: AC0603FR-074K7L; RoHS: RoHS Compliant; Category: Resistors; Stock 1: 391581; Pricing 1: 1=0.1, 10=0.025, 100=0.01, 1000=0.00448, 2500=0.00389 (USD); Packaging: Cut Tape (CT); Part Status: Active; Tolerance: ±1%; Composition: Thick Film; Features: Automotive AEC-Q200, Moisture Resistant; Operating Temperature: -55°C ~ 155°C; Package / Case: 0603 (1608 Metric); Supplier Device Package: 0603; Size / Dimension: 0.063" L x 0.032" W (1.60mm x 0.80mm); Height - Seated (Max): 0.022" (0.55mm); Failure Rate: -; ComponentLink1URL: http://www.yageo.com/NewPortal/yageodocoutput?fileName=/pdf/R-Chip/PYu-AC_51_RoHS_L_6.pdf; ComponentLink1Description: http://www.yageo.com/NewPortal/yageodocoutput?fileName=/pdf/R-Chip/PYu-AC_51_RoHS_L_6.pdf; Resistance: 4k7; Supplier 1: Mouser; Supplier Part Number 1: 603-AC0603FR-074K7L; Supplier 2: Digi-Key; Supplier Part Number 2: YAG3613CT-ND; Supplier 3: Future Electronics; Supplier Part Number 3: AC0603FR-074K7L-CUTT
R23 = AC0603FR-0720KL: RES SMD 20K OHM 1% 1/10W 0603; Manufacturer: Yageo; Power (Watts): 0.1W, 1/10W; Temperature Coefficient: ±100ppm/°C; Manufacturer Part Number: AC0603FR-0720KL; RoHS: RoHS Compliant; Category: Resistors; Stock 1: 120000; Pricing 1: 1=0.1, 10=0.025, 100=0.01, 1000=0.00448, 2500=0.00389 (USD); Packaging: Cut Tape (CT); Part Status: Active; Tolerance: ±1%; Composition: Thick Film; Features: Automotive AEC-Q200, Moisture Resistant; Operating Temperature: -55°C ~ 155°C; Package / Case: 0603 (1608 Metric); Supplier Device Package: 0603; Size / Dimension: 0.063" L x 0.032" W (1.60mm x 0.80mm); Height - Seated (Max): 0.022" (0.55mm); Failure Rate: -; ComponentLink1URL: http://www.yageo.com/NewPortal/yageodocoutput?fileName=/pdf/R-Chip/PYu-AC_51_RoHS_L_6.pdf; ComponentLink1Description: http://www.yageo.com/NewPortal/yageodocoutput?fileName=/pdf/R-Chip/PYu-AC_51_RoHS_L_6.pdf; Resistance: 20k; Supplier 1: Mouser; Supplier Part Number 1: 603-AC0603FR-0720KL; Supplier 2: Digi-Key; Supplier Part Number 2: YAG3577CT-ND
R73 R94 R97 = RC0603FR-0718KL: YAGEO (PHYCOMP) - RC0603FR-0718KL - SMD Chip Resistor, 0603 [1608 Metric], 18 kohm, RC Series, 75 V, Thick Film, 100 mW; Power Rating: 100mW; Voltage Rating: 75V; Voltage Rating (DC): 50V; Temperature Coefficient: 100ppm/°C; Manufacturer: Yageo; Manufacturer Part Number: RC0603FR-0718KL; RoHS: Yes; Category: Chip SMD Resistors; Stock 1: 137359; Pricing 1: 1=0,10000, 10=0,01800, 50=0,01800, 100=0,00600, 1000=0,00500, 10000=0,00300 (USD); Case/Package: 0603; Number of Pins: 2; Case Code (Imperial): 0603; Case Code (Metric): 1608; Weight: 7.1E-05oz; Size Code: 0603; Min Operating Temperature: -55°C; Max Operating Temperature: 155°C; Resistor Type: Thick Film; Resistance: 18k; Tolerance: 1%; Packaging: Tape and Reel; Termination: SMD/SMT; Features: Moisture Resistant; Series: RC; Max Power Dissipation: 100mW; Number of Terminations: 2; Resistance Tolerance: 1%; Technology: THICK FILM; Construction: Rectangular; Length: 1.6mm; Width: 0.8mm; Height: 0.45mm; Depth: 0.8mm; RoHS Compliant: Yes; REACH SVHC: Unknown; Military Standard: Not; Lead Free: Lead Free; ComponentLink1URL: https://datasheet.ciiva.com/11819/0900766b80f96399-11819270.pdf?src-supplier=RSComponents; ComponentLink1Description: https://datasheet.ciiva.com/11819/0900766b80f96399-11819270.pdf?src-supplier=RSComponents; ComponentLink2URL: https://datasheet.ciiva.com/15189/getdatasheetpartid-325162-15189626.pdf?src-supplier=Verical; ComponentLink2Description: https://datasheet.ciiva.com/15189/getdatasheetpartid-325162-15189626.pdf?src-supplier=Verical; ComponentLink3URL: https://datasheet.ciiva.com/7746/443971-7746268.pdf?src-supplier=Element14; ComponentLink3Description: https://datasheet.ciiva.com/7746/443971-7746268.pdf?src-supplier=Element14; ComponentLink4URL: https://datasheet.ciiva.com/7746/443971-7746269.pdf?src-supplier=Element14; ComponentLink4Description: https://datasheet.ciiva.com/7746/443971-7746269.pdf?src-supplier=Element14; Supplier 1: Mouser; Supplier Part Number 1: 603-RC0603FR-0718KL; Supplier 2: Farnell; Supplier Part Number 2: 9238638; Supplier 3: Digi-Key; Supplier Part Number 3: 311-18.0KHRCT-ND
R95 = RC0603FR-07100KL: RES SMD 100K OHM 1% 1/10W 0603; Manufacturer: Yageo; Power (Watts): 0.1W, 1/10W; Temperature Coefficient: ±100ppm/°C; Manufacturer Part Number: RC0603FR-07100KL; RoHS: RoHS Compliant; Category: Resistors; Stock 1: 14618646; Pricing 1: 1=0.1, 10=0.015, 100=0.006, 1000=0.00268, 2500=0.00233 (USD); Packaging: Cut Tape (CT); Part Status: Active; Tolerance: ±1%; Composition: Thick Film; Features: Moisture Resistant; Operating Temperature: -55°C ~ 155°C; Package / Case: 0603 (1608 Metric); Supplier Device Package: 0603; Size / Dimension: 0.063" L x 0.032" W (1.60mm x 0.80mm); Height - Seated (Max): 0.022" (0.55mm); Failure Rate: -; ComponentLink1URL: http://www.yageo.com/documents/recent/PYu-RC_Group_51_RoHS_L_8.pdf; ComponentLink1Description: http://www.yageo.com/documents/recent/PYu-RC_Group_51_RoHS_L_8.pdf; Resistance: 100k; Supplier 1: Mouser; Supplier Part Number 1: 603-RC0603FR-07100KL; Supplier 2: Farnell; Supplier Part Number 2: 9238727; Supplier 3: Digi-Key; Supplier Part Number 3: 311-100KHRCT-ND
R96 = RC0603FR-072KL: RES SMD 2K OHM 1% 1/10W 0603; Manufacturer: Yageo; Power (Watts): 0.1W, 1/10W; Temperature Coefficient: ±100ppm/°C; Manufacturer Part Number: RC0603FR-072KL; RoHS: RoHS Compliant; Category: Resistors; Stock 1: 3375770; Pricing 1: 1=0.1, 10=0.015, 100=0.006, 1000=0.00268, 2500=0.00233 (USD); Packaging: Cut Tape (CT); Part Status: Active; Tolerance: ±1%; Composition: Thick Film; Features: Moisture Resistant; Operating Temperature: -55°C ~ 155°C; Package / Case: 0603 (1608 Metric); Supplier Device Package: 0603; Size / Dimension: 0.063" L x 0.032" W (1.60mm x 0.80mm); Height - Seated (Max): 0.022" (0.55mm); Failure Rate: -; ComponentLink1URL: http://www.yageo.com/documents/recent/PYu-RC_Group_51_RoHS_L_8.pdf; ComponentLink1Description: http://www.yageo.com/documents/recent/PYu-RC_Group_51_RoHS_L_8.pdf; Resistance: 2k; Supplier 1: Mouser; Supplier Part Number 1: 603-RC0603FR-072KL; Supplier 2: Farnell; Supplier Part Number 2: 1799328; Supplier 3: Digi-Key; Supplier Part Number 3: 311-2.00KHRCT-ND; Supplier 4: Arrow; Supplier Part Number 4: RC0603FR-072KL
T2 T3 = TC16-161T+: RF Transformer, 50 ohm, 16.0: 1, 0.60-160 MHz, SMT; Manufacturer: Mini-Circuits; Supplier 1: Mouser; Supplier Part Number 1: 139-TC16-161T; Manufacturer Part Number: TC16-161T+; RoHS: Yes; Stock 1: 1094; Pricing 1: 1=3.45000, 10=2.88000, 50=2.88000, 100=2.36000, 250=1.96000, 500=1.84000, 1000=1.73000, 2000=1.64000, 4000=1.52000, 10000=1.49000 (USD); RoHS Compliant: Yes; Supplier 2: Digi-Key; Supplier Part Number 2: 3157-TC16-161T+CT-ND
U12 = F-10M7-K6: 10.7 MHz crystal band-pass filter, 8 poles / - Bandwidth (-3dB): 12 KHz / - Selectivity: 90 dB / - Impedance: 900 Ω / - Dimensions: 38 x 18 mm, h 12 mm
U13 = TL026CD: Differential High-Frequency Amplifier with AGC 8-SOIC 0 to 70; Manufacturer: Texas Instruments; Common Mode Rejection Ratio: 60dB; Max Power Dissipation: 725mW; -3db Bandwidth: 50MHz; Nominal Supply Current: 27mA; Max Dual Supply Voltage: 8V; Min Dual Supply Voltage: 3V; Dual Supply Voltage: 6V; Voltage Gain: 38.59dB; Number of Channels: 1; Input Bias Current: 30uA; Operating Supply Current: 22mA; Output Current per Channel: 4mA; Operating Supply Voltage: 16V; Supplier 1: Mouser; Supplier Part Number 1: 595-TL026CD; Manufacturer Part Number: TL026CD; RoHS: Yes; Category: Amplifiers - Op Amps, Buffer, Instrumentation; Stock 1: 1672; Pricing 1: 1=2.57000, 10=2.46000, 50=2.46000, 100=2.45000, 1000=2.45000, 10000=1.45000 (USD); Case/Package: D; Number of Pins: 8; Weight: 0.002561oz; Min Operating Temperature: 0°C; Max Operating Temperature: 70°C; Packaging: Rail/Tube; Package Quantity: 75; Bandwidth: 50MHz; Number of Circuits: 1; Supply Current: 27mA; Series: TL026; Max Supply Voltage: 8V; Min Supply Voltage: 3V; Number of Elements: 1; Power Dissipation: 725mW; Number of Amplifiers: 1; Technology: JFET; Length: 4.9mm; Width: 3.91mm; Height: 1.58mm; Radiation Hardening: No; Lead Free: Lead Free; RoHS Compliant: Yes; REACH SVHC: No SVHC; ComponentLink1URL: https://datasheet.ciiva.com/26857/tl026cd-26857756.pdf?src-supplier=IIIC; ComponentLink1Description: https://datasheet.ciiva.com/26857/tl026cd-26857756.pdf?src-supplier=IIIC; ComponentLink2URL: https://datasheet.ciiva.com/28430/slfs007a-28430037.pdf?src-supplier=Avnet+Europe; ComponentLink2Description: https://datasheet.ciiva.com/28430/slfs007a-28430037.pdf?src-supplier=Avnet+Europe; ComponentLink3URL: https://datasheet.ciiva.com/26815/getdatasheetpartid-48553-26815191.pdf?src-supplier=Verical; ComponentLink3Description: https://datasheet.ciiva.com/26815/getdatasheetpartid-48553-26815191.pdf?src-supplier=Verical; ComponentLink4URL: https://datasheet.ciiva.com/1488/1835114-1488075.pdf?src-supplier=Element14; ComponentLink4Description: https://datasheet.ciiva.com/1488/1835114-1488075.pdf?src-supplier=Element14; ComponentLink5URL: https://datasheet.ciiva.com/1824/tl026-1824398.pdf?src-supplier=Digi-Key; ComponentLink5Description: https://datasheet.ciiva.com/1824/tl026-1824398.pdf?src-supplier=Digi-Key; ComponentLink6URL: https://datasheet.ciiva.com/48712/001011461-da-01-en-agc-video-amplifier-tl026cd-soic-8-tid-48712348.pdf?src-supplier=Conrad; ComponentLink6Description: https://datasheet.ciiva.com/48712/001011461-da-01-en-agc-video-amplifier-tl026cd-soic-8-tid-48712348.pdf?src-supplier=Conrad; Supplier 2: Farnell; Supplier Part Number 2: 1459444; Supplier 3: Digi-Key; Supplier Part Number 3: 296-11818-5-ND
U14 U15 = SKY65017-70LF: IC AMP INGAP LF-6GHZ SOT-89; Manufacturer: Skyworks Solutions Inc.; Frequency: 0.1Hz ~ 6GHz; P1dB: 20dBm (100mW); Gain: 20dB; Noise Figure: 5dB; RF Type: DBS, HLAN, WLAN; Voltage - Supply: 4.5 V ~ 5.5 V; Current - Supply: 120mA; Test Frequency: 2GHz; Manufacturer Part Number: SKY65017-70LF; RoHS: RoHS Compliant; Category: RF/IF and RFID; Stock 1: 6721; Pricing 1: 1=3, 10=2.683, 25=2.4144, 100=2.1999, 250=1.98524, 500=1.78134 (USD); Packaging: Cut Tape (CT); Part Status: Active; Package / Case: TO-243AA; Supplier Device Package: SOT-89-3; ComponentLink1URL: http://www.skyworksinc.com/uploads/documents/SKY65017_70LF_200528G.pdf; ComponentLink1Description: http://www.skyworksinc.com/uploads/documents/SKY65017_70LF_200528G.pdf; Supplier 1: Mouser; Supplier Part Number 1: 873-SKY65017-70LF; Supplier 2: Digi-Key; Supplier Part Number 2: 863-1063-1-ND
U16 = LM324PWR: OP-AMP, 1.2MHZ, 0.5V/ US, TSSOP-14; Manufacturer: TEXAS INSTRUMENTS; Bandwidth: 1.2; No. of Amplifiers: 4; Slew Rate: 0.5; Supply Voltage Range: ± 1.5V to ± 16; Amplifier Case Style: TSSOP; No. of Pins: 14; SVHC: No SVHC (17-Dec-2014); Filter Terminals: SMD; Input Bias Current: 250000; Op Amp Type: High Gain; Output Current: 20; Quiescent Current: 0.3; Supply Voltage Max: 32; Supply Voltage Min: 3; Manufacturer Part Number: LM324PWR; RoHS: YES; Stock 1: 1889; Pricing 1: 5=0,171, 50=0,15, 250=0,126, 500=0,125, 1000=0,125 (EUR); Operating Temperature Min: 0; Operating Temperature Max: 70; Packaging: Cut Tape; MSL: MSL 1 - Unlimited; Amplifer Supply Voltage: ± 1.5V to ± 16; Operating Temperature Range: 0°C to +70; ComponentLink1URL: http://www.farnell.com/datasheets/1877076.pdf; ComponentLink1Description: http://www.farnell.com/datasheets/1877076.pdf; Stock 3: 1204; Pricing 3: 1=0,24, 10=0,23, 100=0,23, 250=0,22, 500=0,21, 1000=0,21, 3000=0,171, 10000=0,157 (EUR); ComponentLink2URL: http://www.farnell.com/datasheets/378369.pdf; ComponentLink2Description: http://www.farnell.com/datasheets/378369.pdf; Supplier 1: Mouser; Supplier 2: Farnell; Supplier Part Number 2: 2342289; Supplier Part Number 1: 595-LM324PWR

## Sheet MIXER 2.SchDoc
size A4; SheetNumber: 5; SheetTotal: 12
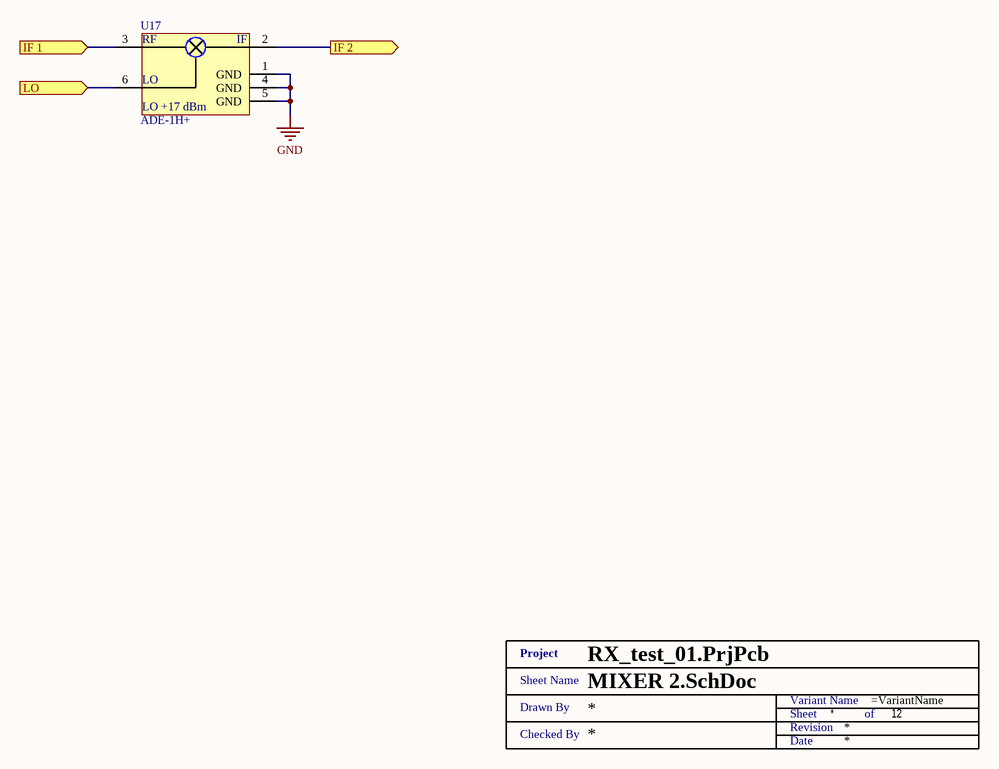
[diagram p4: MIXER 2.SchDoc]

### Parts
(Parts that share a designator on the sheet are numbered #1, #2 ... from top to bottom, then left to right.)
U17  ADE-1H+  [ADT1-6T]
XX?#5  Title 1  (value not drawn)  (graphical)

### Ports
IF 1 (in), IF 2 (out), LO (in)

### Nets
GND: U17.1(GND) U17.4(GND) U17.5(GND)
NetJ12_3: U17.3(RF) ; port IF 1
NetJ13_2: U17.2(IF) ; port IF 2
NetR24_2: U17.6(LO) ; port LO

### Notes on the sheet
- (in symbol ADE-1H+) LO +17 dBm
- (in symbol Title 1) Project; Sheet Name; Variant Name; Drawn By; Sheet; of; Revision; Checked By; Date

### Library data of the parts
U17 = ADE-1H+: RF Mixer, 0.50 to 500 MHz, SMT; Manufacturer: Mini-Circuits; Supplier 1: Mouser; Supplier Part Number 1: 139-ADE-1H; Manufacturer Part Number: ADE-1H+; RoHS: Yes; Category: RF Mixers; Stock 1: 949; Pricing 1: 1=8.29000, 10=7.49000, 50=7.14000, 100=6.20000, 1000=4.69000, 10000=4.69000 (USD); Supplier 2: Digi-Key; Supplier Part Number 2: 3157-ADE-1H+CT-ND